# Altium schematic sheet MainBoard_Interface_ProyimityDetector.SchDoc: Main Board Interface Proximity Detector
size A4; DrawnBy: M. Schwegler; Organization: HSLU T&A; Address1: Abteilung Elektrotechnik; Address2: Technikumsstrasse 21; Address3: CH-6048 Horw; Revision: v1; SheetNumber: 5; SheetTotal: 5; Projektname: SmartBoard; DocumentName: MainBoard; ProjectName: SmartBoard
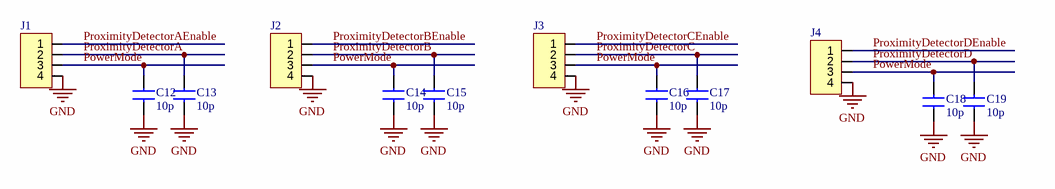
[diagram p0: MainBoard_Interface_ProyimityDetector.SchDoc]

## Parts
C12  10p  [0805_C]
C13  10p  [0805_C]
C14  10p  [0805_C]
C15  10p  [0805_C]
C16  10p  [0805_C]
C17  10p  [0805_C]
C18  10p  [0805_C]
C19  10p  [0805_C]
J1  (no value)  [CON_THT_4P_RM2.54]
J2  (no value)  [CON_THT_4P_RM2.54]
J3  (no value)  [CON_THT_4P_RM2.54]
J4  (no value)  [CON_THT_4P_RM2.54]

## Nets
GND: C12.1 C13.1 C14.1 C15.1 C16.1 C17.1 C18.1 C19.1 J1.4 J2.4 J3.4 J4.4
PowerMode: C12.2 C14.2 C16.2 C18.2 J1.3 J2.3 J3.3 J4.3
ProximityDetectorA: C13.2 J1.2
ProximityDetectorAEnable: J1.1
ProximityDetectorB: C15.2 J2.2
ProximityDetectorBEnable: J2.1
ProximityDetectorC: C17.2 J3.2
ProximityDetectorCEnable: J3.1
ProximityDetectorD: C19.2 J4.2
ProximityDetectorDEnable: J4.1

## Notes on the sheet
- Project:
- Drawn by:
- Size:
- Sheet
- A4
- Rev.:
- of
- Date:
- File:

## Library data of the parts
C12-C19 = C?: Normaler Kondensator
J1-J4 = CON_4P